# Altium schematic sheet epaper.SchDoc
size A; SheetNumber: 2; SheetTotal: 3
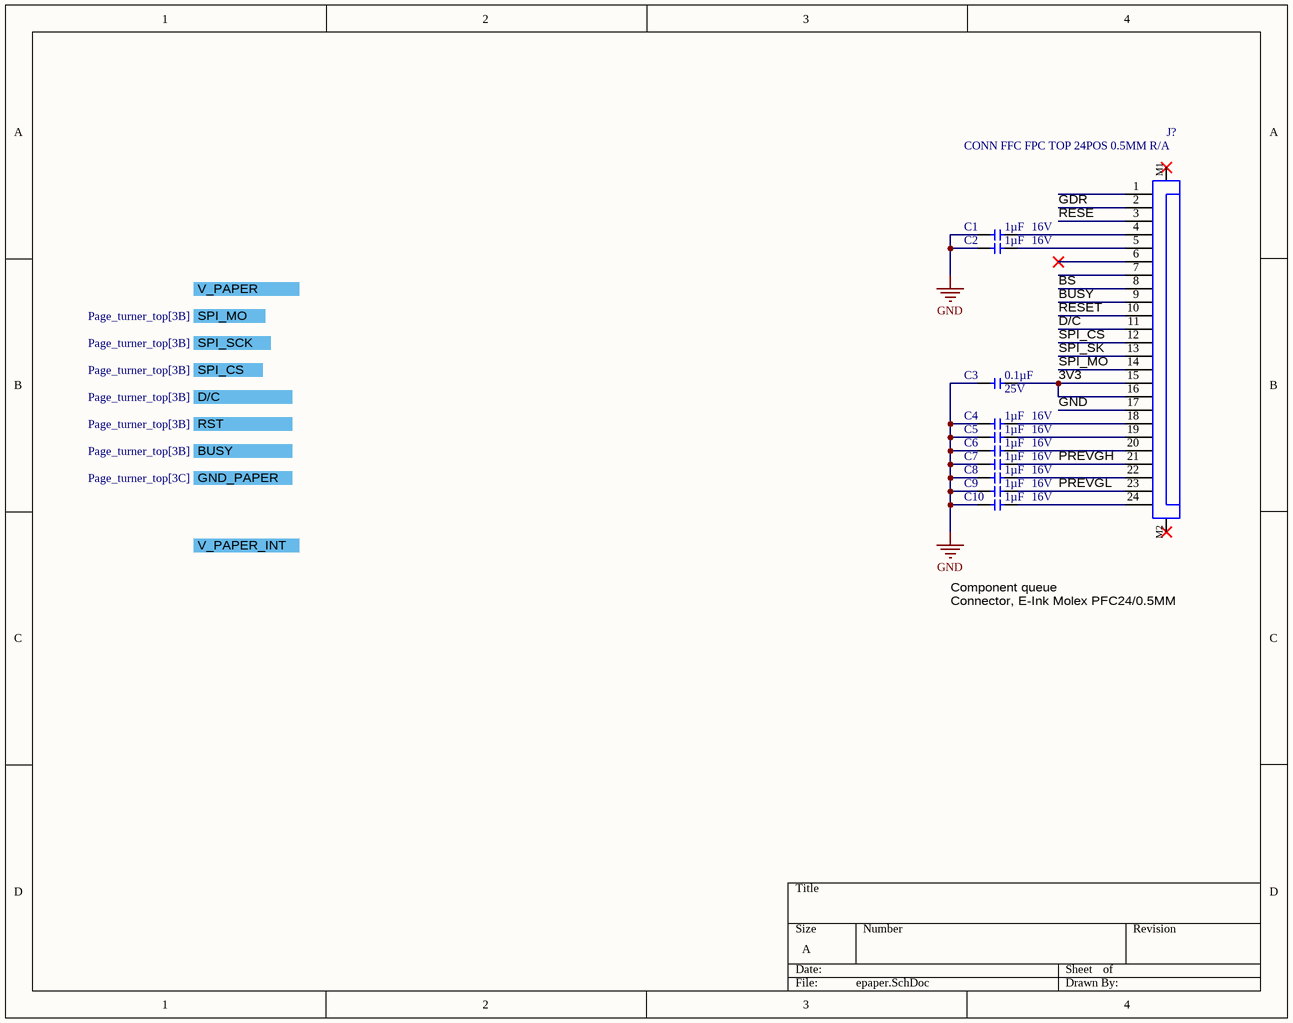
[diagram p0: epaper.SchDoc]

## Parts
C1  value 1µF  Voltage: 16V  [CAPC_0402_L1W0.5H0.5]  (hidden comment: CAP CER 1UF 16V X6S 0402)
C2  value 1µF  Voltage: 16V  [CAPC_0402_L1W0.5H0.5]  (hidden comment: CAP CER 1UF 16V X6S 0402)
C3  value 0.1µF  Voltage: 25V  [CAPC_0402_L1W0.5H0.5]  (hidden comment: CAP CER 0.1UF 25V X7R 0402)
C4  value 1µF  Voltage: 16V  [CAPC_0402_L1W0.5H0.5]  (hidden comment: CAP CER 1UF 16V X6S 0402)
C5  value 1µF  Voltage: 16V  [CAPC_0402_L1W0.5H0.5]  (hidden comment: CAP CER 1UF 16V X6S 0402)
C6  value 1µF  Voltage: 16V  [CAPC_0402_L1W0.5H0.5]  (hidden comment: CAP CER 1UF 16V X6S 0402)
C7  value 1µF  Voltage: 16V  [CAPC_0402_L1W0.5H0.5]  (hidden comment: CAP CER 1UF 16V X6S 0402)
C8  value 1µF  Voltage: 16V  [CAPC_0402_L1W0.5H0.5]  (hidden comment: CAP CER 1UF 16V X6S 0402)
C9  value 1µF  Voltage: 16V  [CAPC_0402_L1W0.5H0.5]  (hidden comment: CAP CER 1UF 16V X6S 0402)
C10  value 1µF  Voltage: 16V  [CAPC_0402_L1W0.5H0.5]  (hidden comment: CAP CER 1UF 16V X6S 0402)
J?  CONN FFC FPC TOP 24POS 0.5MM R/A  [F32Q-1A7H1-11024]

## Ports
BUSY (see Page_turner_top[3B]), D/C (see Page_turner_top[3B]), GND_PAPER (see Page_turner_top[3C]), RST (see Page_turner_top[3B]), SPI_CS (see Page_turner_top[3B]), SPI_MO (see Page_turner_top[3B]), SPI_SCK (see Page_turner_top[3B]), V_PAPER, V_PAPER_INT

## Nets
GND: C1.1 C2.1 C3.1 C4.1 C5.1 C6.1 C7.1 C8.1 C9.1 C10.1 J?.17
3V3: C3.2 J?.15 J?.16
BS: J?.8
BUSY: J?.9
D/C: J?.11
GDR: J?.2
PREVGH: C7.2 J?.21
PREVGL: C9.2 J?.23
RESE: J?.3
RESET: J?.10
SPI_CS: J?.12
SPI_MO: J?.14
SPI_SK: J?.13
NetC1_2: C1.2 J?.4
NetC2_2: C2.2 J?.5
NetC4_2: C4.2 J?.18
NetC5_2: C5.2 J?.19
NetC6_2: C6.2 J?.20
NetC8_2: C8.2 J?.22
NetC10_2: C10.2 J?.24

Not connected (* = marked no-connect by the designer): J? 1 6* 7 M1* M2*

## Notes on the sheet
- Component queue
  Connector, E-Ink Molex PFC24/0.5MM

## Library data of the parts
C1 C2 C4-C10 = CER1.0UF16V0402X6S: 1 µF ±10% 16V Ceramic Capacitor X6S 0402 (1005 Metric); Manufacturer Part Number 1: GRM155C81C105KE15J; Manufacturer 1: Murata Electronics; Tolerance: ±10%; Operating Temperature: -55°C ~ 105°C; Package: 0402 (1005 Metric); Type: Ceramic
C3 = CER0.1UF25V0402X7R: 0.1 µF ±10% 25V Ceramic Capacitor X7R 0402 (1005 Metric); Manufacturer Part Number 1: GRM155R71E104KE14J; Manufacturer 1: Murata Electronics; Tolerance: ±10%; Operating Temperature: -55°C ~ 125°C; Package: 0402 (1005 Metric); Type: Ceramic
J? = F32Q-1A7H1-11024: 24 Position FFC, FPC Connector Contacts, Top 0.020" (0.50mm) Surface Mount, Right Angle; Manufacturer 1: Amphenol ICC (FCI); Voltage Rating: 50V; Current Rating: 0.5A; Number of Positions: 24; Notes: Slide Lock; Operating Temperature: -40°C ~ 105°C; Contact Finish: Gold; Manufacturer Part Number 1: F32Q-1A7H1-11024; Pitch: 0.020" (0.50mm); Series: Aorora F32Q